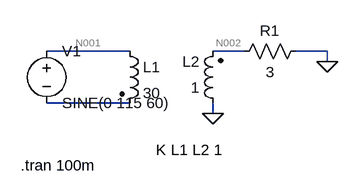
[diagram p0: schematic Draft1.asc]
Draft1.asc, the LTspice schematic file:
Version 4
SHEET 1 880 680
WIRE 176 48 48 48
WIRE 352 48 304 48
WIRE 480 48 432 48
WIRE 480 64 480 48
WIRE 176 128 48 128
WIRE 304 144 304 128
FLAG 304 144 0
FLAG 480 64 0
SYMBOL voltage 48 32 R0
WINDOW 123 0 0 Left 0
WINDOW 39 0 0 Left 0
SYMATTR InstName V1
SYMATTR Value SINE(0 115 60)
SYMBOL ind2 160 32 R0
SYMATTR InstName L1
SYMATTR Value 30
SYMATTR Type ind
SYMATTR SpiceLine Rser=0.0001
SYMBOL ind2 320 144 R180
WINDOW 0 36 80 Left 2
WINDOW 3 36 40 Left 2
SYMATTR InstName L2
SYMATTR Value 1
SYMATTR Type ind
SYMBOL res 448 32 R90
WINDOW 0 0 56 VBottom 2
WINDOW 3 32 56 VTop 2
SYMATTR InstName R1
SYMATTR Value 3
TEXT 216 200 Left 2 !K L1 L2 1
TEXT 8 224 Left 2 !.tran 100m

The netlist it stands for:
* Draft1.asc
V1 N001 N003 SINE(0 115 60)
L1 N001 N003 30 Rser=0.0001
L2 0 N002 1
R1 0 N002 3
K L1 L2 1
.tran 100m
.backanno
.end

* Results of the author's LTspice run, read from the files saved beside the schematic
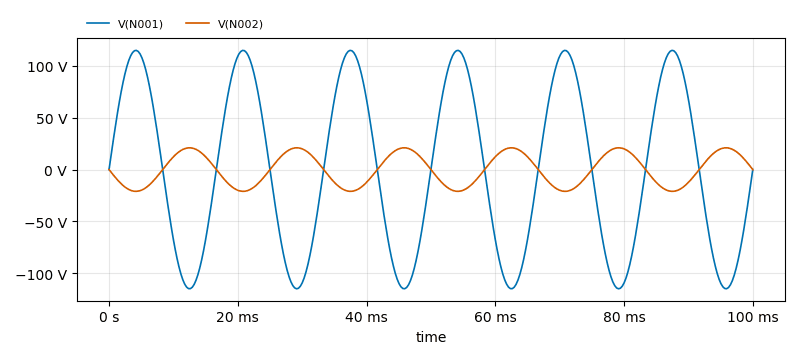
[diagram p1: Transient Analysis of Draft1.asc, plotted from the saved traces]
* Transient Analysis, 1 run:
*   V(N001): min -115 V, max 115 V, average -16.62 µV, rms 81.31 V, last 0 V
*   V(N002): min -20.98 V, max 20.99 V, average 3.118 µV, rms 14.84 V, last 5.278 µV